# Altium schematic sheet config.SchDoc
size A3
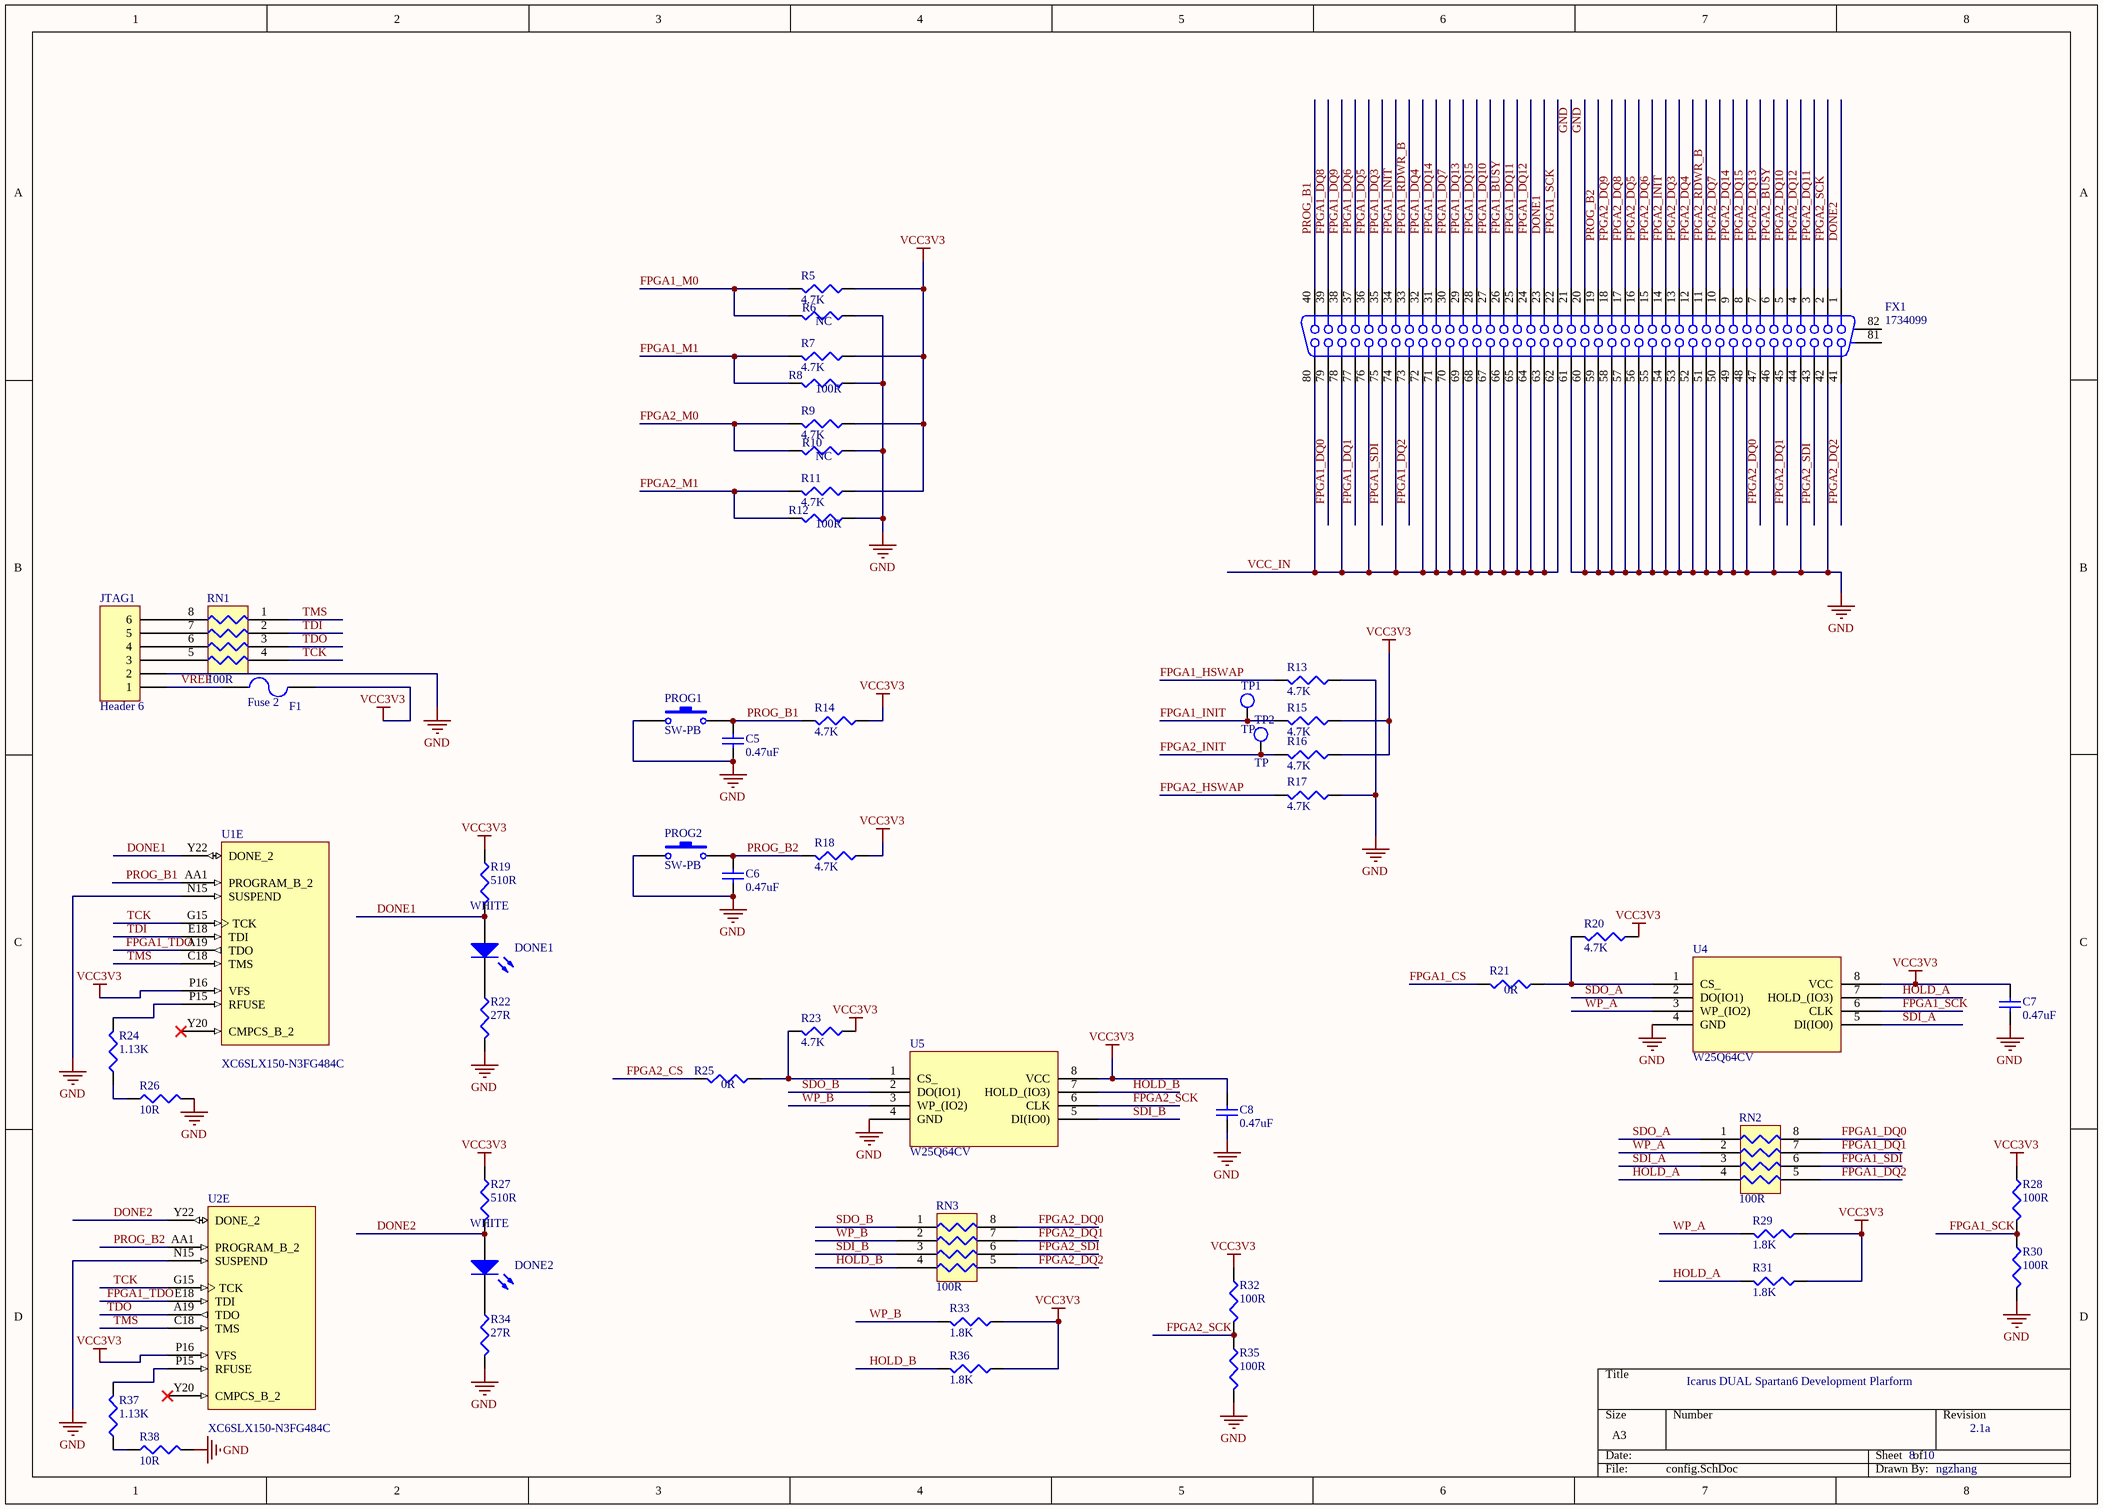
[diagram p0: config.SchDoc]

## Parts
C5  0.47uF  [CAPC1005N]
C6  0.47uF  [CAPC1005N]
C7  0.47uF  [CAPC1005N]
C8  0.47uF  [CAPC1005N]
DONE1  WHITE  [CD1608-0603]
DONE2  WHITE  [CD1608-0603]
F1  Fuse 2  [RESC3216N]
FX1  1734099  [1734099]
JTAG1  Header 6  [HDR1X6]
PROG1  SW-PB  [SKQMA]
PROG2  SW-PB  [SKQMA]
R5  4.7K  [RESC1005N]
R6  NC  [RESC1005N]
R7  4.7K  [RESC1005N]
R8  100R  [RESC1005N]
R9  4.7K  [RESC1005N]
R10  NC  [RESC1005N]
R11  4.7K  [RESC1005N]
R12  100R  [RESC1005N]
R13  4.7K  [RESC1005N]
R14  4.7K  [RESC1005N]
R15  4.7K  [RESC1005N]
R16  4.7K  [RESC1005N]
R17  4.7K  [RESC1005N]
R18  4.7K  [RESC1005N]
R19  510R  [RESC1005N]
R20  4.7K  [RESC1005N]
R21  0R  [RESC1005N]
R22  27R  [RESC1005N]
R23  4.7K  [RESC1005N]
R24  1.13K  [RESC1608N]
R25  0R  [RESC1005N]
R26  10R  [RESC1608N]
R27  510R  [RESC1005N]
R28  100R  [RESC1005N]
R29  1.8K  [RESC1005N]
R30  100R  [RESC1005N]
R31  1.8K  [RESC1005N]
R32  100R  [RESC1005N]
R33  1.8K  [RESC1005N]
R34  27R  [RESC1005N]
R35  100R  [RESC1005N]
R36  1.8K  [RESC1005N]
R37  1.13K  [RESC1608N]
R38  10R  [RESC1608N]
RN1  100R  [EXBV8V]
RN2  100R  [EXBV8V]
RN3  100R  [EXBV8V]
TP1  TP  [TP]
TP2  TP  [TP]
U1  XC6SLX150-N3FG484C  [FG484]  (part E of 7)
U2  XC6SLX150-N3FG484C  [FG484]  (part E of 7)
U4  W25Q64CV  [WSOP8]
U5  W25Q64CV  [WSOP8]

## Nets
GND: C5.2 C6.2 C7.1 C8.1 FX1.20 FX1.21 FX1.42 FX1.44 FX1.46 FX1.48 FX1.49 FX1.50 FX1.51 FX1.52 FX1.53 FX1.54 FX1.55 FX1.56 FX1.57 FX1.58 FX1.59 FX1.60 FX1.61 JTAG1.2 PROG1.1 PROG2.1 R6.1 R8.1 R10.1 R12.1 R13.1 R17.1 R22.2 R26.2 R30.2 R34.2 R35.2 R38.2 U1.N15(SUSPEND) U2.N15(SUSPEND) U4.4(GND) U5.4(GND)
VCC3V3: C7.2 C8.2 F1.2 R5.1 R7.1 R9.1 R11.1 R14.1 R15.1 R16.1 R18.1 R19.1 R20.1 R23.1 R27.1 R28.1 R29.1 R31.1 R32.1 R33.1 R36.1 U1.P16(VFS) U2.P16(VFS) U4.8(VCC) U5.8(VCC)
DONE1: DONE1.1(A) FX1.23 R19.2 U1.Y22(DONE_2)
DONE2: DONE2.1(A) FX1.1 R27.2 U2.Y22(DONE_2)
FPGA1_BUSY: FX1.26
FPGA1_CS: R21.2
FPGA1_DQ0: FX1.79 RN2.8
FPGA1_DQ1: FX1.77 RN2.7
FPGA1_DQ2: FX1.73 RN2.5
FPGA1_DQ3: FX1.35
FPGA1_DQ4: FX1.32
FPGA1_DQ5: FX1.36
FPGA1_DQ6: FX1.37
FPGA1_DQ7: FX1.30
FPGA1_DQ8: FX1.39
FPGA1_DQ9: FX1.38
FPGA1_DQ10: FX1.27
FPGA1_DQ11: FX1.25
FPGA1_DQ12: FX1.24
FPGA1_DQ13: FX1.29
FPGA1_DQ14: FX1.31
FPGA1_DQ15: FX1.28
FPGA1_HSWAP: R13.2
FPGA1_INIT: FX1.34 R15.2 TP1.1(TP)
FPGA1_M0: R5.2 R6.2
FPGA1_M1: R7.2 R8.2
FPGA1_RDWR_B: FX1.33
FPGA1_SCK: FX1.22 R28.2 R30.1 U4.6(CLK)
FPGA1_SDI: FX1.75 RN2.6
FPGA1_TDO: U1.A19(TDO) U2.E18(TDI)
FPGA2_BUSY: FX1.6
FPGA2_CS: R25.2
FPGA2_DQ0: FX1.47 RN3.8
FPGA2_DQ1: FX1.45 RN3.7
FPGA2_DQ2: FX1.41 RN3.5
FPGA2_DQ3: FX1.13
FPGA2_DQ4: FX1.12
FPGA2_DQ5: FX1.16
FPGA2_DQ6: FX1.15
FPGA2_DQ7: FX1.10
FPGA2_DQ8: FX1.17
FPGA2_DQ9: FX1.18
FPGA2_DQ10: FX1.5
FPGA2_DQ11: FX1.3
FPGA2_DQ12: FX1.4
FPGA2_DQ13: FX1.7
FPGA2_DQ14: FX1.9
FPGA2_DQ15: FX1.8
FPGA2_HSWAP: R17.2
FPGA2_INIT: FX1.14 R16.2 TP2.1(TP)
FPGA2_M0: R9.2 R10.2
FPGA2_M1: R11.2 R12.2
FPGA2_RDWR_B: FX1.11
FPGA2_SCK: FX1.2 R32.2 R35.1 U5.6(CLK)
FPGA2_SDI: FX1.43 RN3.6
HOLD_A: R31.2 RN2.4 U4.7(HOLD_(IO3))
HOLD_B: R36.2 RN3.4 U5.7(HOLD_(IO3))
PROG_B1: C5.1 FX1.40 PROG1.2 R14.2 U1.AA1(PROGRAM_B_2)
PROG_B2: C6.1 FX1.19 PROG2.2 R18.2 U2.AA1(PROGRAM_B_2)
SDI_A: RN2.3 U4.5(DI(IO0))
SDI_B: RN3.3 U5.5(DI(IO0))
SDO_A: RN2.1 U4.2(DO(IO1))
SDO_B: RN3.1 U5.2(DO(IO1))
TCK: RN1.4 U1.G15(TCK) U2.G15(TCK)
TDI: RN1.2 U1.E18(TDI)
TDO: RN1.3 U2.A19(TDO)
TMS: RN1.1 U1.C18(TMS) U2.C18(TMS)
VCC_IN: FX1.62 FX1.63 FX1.64 FX1.65 FX1.66 FX1.67 FX1.68 FX1.69 FX1.70 FX1.71 FX1.72 FX1.74 FX1.76 FX1.78 FX1.80
VREF: F1.1 JTAG1.1
WP_A: R29.2 RN2.2 U4.3(WP_(IO2))
WP_B: R33.2 RN3.2 U5.3(WP_(IO2))
NetDONE1_2: DONE1.2(K) R22.1
NetDONE2_2: DONE2.2(K) R34.1
NetJTAG1_3: JTAG1.3 RN1.5
NetJTAG1_4: JTAG1.4 RN1.6
NetJTAG1_5: JTAG1.5 RN1.7
NetJTAG1_6: JTAG1.6 RN1.8
NetR20_2: R20.2 R21.1 U4.1(CS_)
NetR23_2: R23.2 R25.1 U5.1(CS_)
NetR24_1: R24.1 R26.1
NetR24_2: R24.2 U1.P15(RFUSE)
NetR37_1: R37.1 R38.1
NetR37_2: R37.2 U2.P15(RFUSE)

Not connected (* = marked no-connect by the designer): FX1 81(MH1) 82(MH2); U1 Y20(CMPCS_B_2)*; U2 Y20(CMPCS_B_2)*

## Notes on the sheet
- Icarus DUAL Spartan6 Development Plarform
- 8
- 10
- 2.1a
- ngzhang

## Library data of the parts
C5-C8 = Cap Semi: Capacitor (Semiconductor SIM Model); Published: 8-Jun-2000; LatestRevisionDate: 29-May-2009; LatestRevisionNote: IPC-7351 Footprint Added.; PackageReference: C1206; Publisher: Altium Limited; PackageDescription: Chip Capacitor; Value: 0.47uF
DONE1 DONE2 = LED3: Typical BLUE SiC LED; Published: 8-Jun-2000; LatestRevisionDate: 17-Dec-2003; LatestRevisionNote: PCB Footprint replaced.; DatasheetVersion: 16-Apr-2002; PackageVersion: 16-Apr-2002; PackageReference: 3.5X2.8X1.9; Publisher: Altium Limited; PackageDescription: SM LED; 2 C-Bend Leads; Body 3.5 x 2.8 x 1.9 mm, inc leads (LxWxH typ)
F1 = Fuse 2: Fuse; Published: 8-Jun-2000; LatestRevisionDate: 17-Jul-2002; LatestRevisionNote: Re-released for DXP Platform.; PackageReference: PIN-W2/E2.8; Publisher: Altium Limited
JTAG1 = Header 6: Header, 6-Pin; LatestRevisionDate: 17-Jul-2002; LatestRevisionNote: Re-released for DXP Platform.; Publisher: Altium Limited
PROG1 PROG2 = SW-PB: Switch; Published: 24-Mar-1999; LatestRevisionDate: 17-Jul-2002; LatestRevisionNote: Re-released for DXP Platform.; PackageReference: SPST-2; Publisher: Altium Limited; PackageDescription: Switch; 2 Leads
R5-R38 = Res3: Resistor; Published: 8-Jun-2000; LatestRevisionDate: 29-May-2009; LatestRevisionNote: IPC-7351 Footprint Added.; PackageReference: J1-0603; Publisher: Altium Limited; PackageDescription: Chip Resistor
  R5 R7 R9 R11 R13-R18 R20 R23: Value: 4.7K
  R6 R10: Value: NC
  R8 R12 R28 R30 R32 R35: Value: 100R
  R19 R27: Value: 510R
  R21 R25: Value: 0R
  R22 R34: Value: 27R
  R24 R37: Value: 1.13K
  R26 R38: Value: 10R
  R29 R31 R33 R36: Value: 1.8K
RN1-RN3 = RES4PACK
U1 U2 = XC6SLX150-N3FG484C: Spartan-6 LX 1.2V FPGA, 338 User I/Os, 484-Ball Fine-Pitch BGA (1.0mm Pitch), Speed Grade 3N, Commercial Grade; Published: 24-Aug-2010; DatasheetVersion: ver1.6, Nov-2010; PackageVersion: ver1.1, Dec-2008; PackageReference: FG484; Publisher: Altium Limited; PackageDescription: 484-Ball Fine Pitch Ball Grid Array 1.00 mm Pitch (FG484); Code_JEDEC: MS-034-AAJ-1; Code_IPC: BGA100P22X22-484; ComponentLink1Description: Manufacturer Link; ComponentLink1URL: http://www.xilinx.com; ComponentLink2Description: Spartan-6 Datasheet; ComponentLink2URL: http://www.xilinx.com/support/documentation/data_sheets/ds160.pdf; ComponentLink3Description: Spartan-6 Documents; ComponentLink3URL: http://www.xilinx.com/support/documentation/spartan-6.htm; ComponentLink4Description: Xilinx.com Home; ComponentLink4URL: http://www.xilinx.com